# Altium schematic sheet 3.3V_REG_1A.SchDoc
size A4
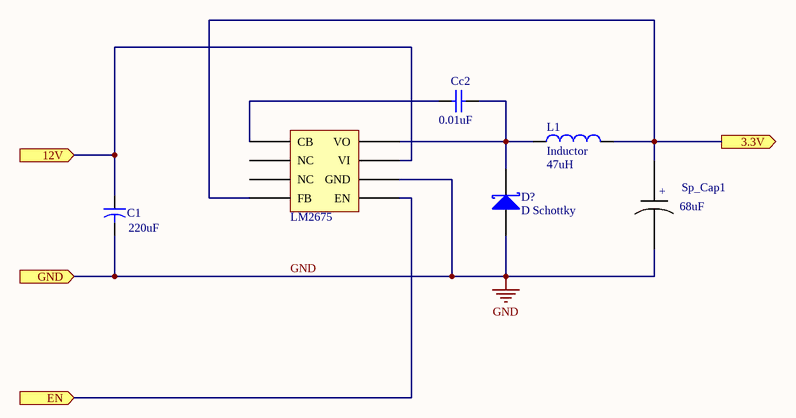
[diagram p0: 3.3V_REG_1A.SchDoc]

## Parts
C1  value 220uF  [CAPR5-4X5]  (hidden comment: Cap2)
Cc2  value 0.01uF  [C1206]  (hidden comment: Cap Semi)
D?  D Schottky  [SMB]
L1  Inductor  value 47uH  [0402-A]
LM2675  LM2675  [SOIC8-LM2675]  (value not drawn)
Sp_Cap1  value 68uF  (hidden comment: Sprague_capacitor)

## Ports
3.3V (out), 12V (in), EN (in), GND (in)

## Nets
GND: C1.2 D?.1(A) LM2675.GND Sp_Cap1.?2 ; port GND
3.3V: L1.2 LM2675.FB Sp_Cap1.?1 ; port 3.3V
12V: C1.1 LM2675.VI ; port 12V
EN: LM2675.EN ; port EN
NetCc2_1: Cc2.1 LM2675.CB
NetCc2_2: Cc2.2 D?.2(K) L1.1 LM2675.VO

Not connected (* = marked no-connect by the designer): LM2675 NC

## Notes on the sheet
- (in symbol Sprague_capacitor) +

## Library data of the parts
C1 = Cap2: Capacitor; Published: 23-Sep-2002; PackageReference: CAPR5-4X5; Publisher: Altium Limited; PackageDescription: Capacitor; 2 Leads
Cc2 = Cap Semi: Capacitor (Semiconductor SIM Model); Published: 8-Jun-2000; LatestRevisionDate: 29-May-2009; LatestRevisionNote: IPC-7351 Footprint Added.; PackageReference: C1206; Publisher: Altium Limited; PackageDescription: Chip Capacitor
D? = D Schottky: Schottky Diode; Published: 8-Jun-2000; LatestRevisionDate: 17-Jul-2002; LatestRevisionNote: Re-released for DXP Platform.; PackageReference: SMB; Publisher: Altium Limited; PackageDescription: DO-214-AA/SMB; 2 C-Bend Leads; Body 5.3 x 3.6 mm, inc. leads (LxW); Code_JEDEC: DO-214-AA
L1 = Inductor: Code_IEC: 1005; Published: 8-Jun-2000; LatestRevisionDate: 29-May-2009; LatestRevisionNote: IPC-7351 Footprint Added.; PackageReference: 0402-A; Publisher: Altium Limited; PackageDescription: Chip Inductor; Code_JEITA: 0402
LM2675 = LM2675: 3.3 Step-down (1A); HelpURL: http://www.ti.com/lit/ds/symlink/lm2675.pdf
Sp_Cap1 = Sprague_capacitor: Sprague Tantalum Capacitor; HelpURL: http://www.mouser.es/ProductDetail/Vishay-Sprague/594D686X0010C2T/?qs=sGAEpiMZZMuEN2agSAc2pn0KQ7q64aCR6Bnog1kvSjk%3d